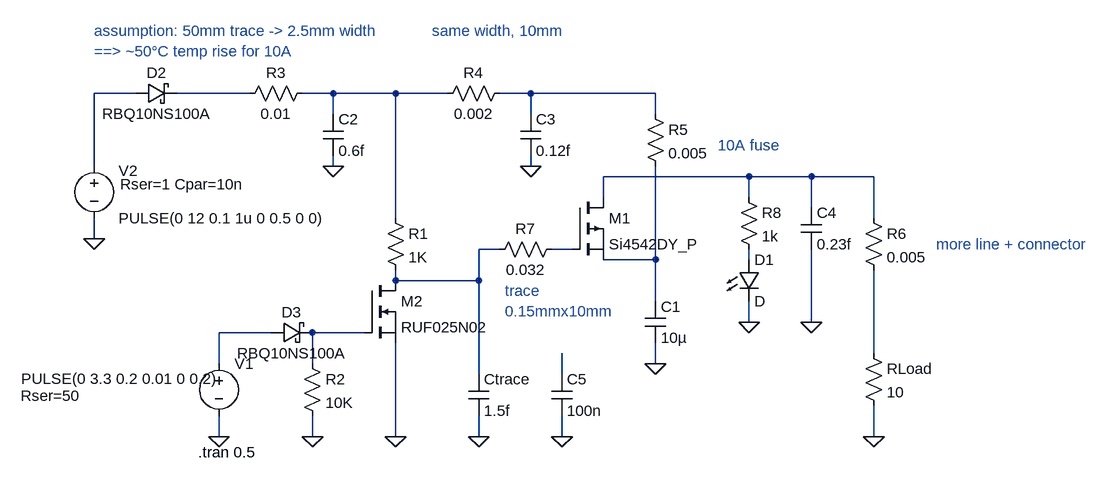
[diagram p0: schematic recovery_output.asc]
recovery_output.asc, the LTspice schematic file:
Version 4.1
SHEET 1 1044 1256
WIRE -448 -80 -512 -80
WIRE -272 -80 -384 -80
WIRE -144 -80 -192 -80
WIRE -48 -80 -144 -80
WIRE 32 -80 -48 -80
WIRE 160 -80 112 -80
WIRE 352 -80 160 -80
WIRE -144 -48 -144 -80
WIRE 160 -48 160 -80
WIRE 352 -48 352 -80
WIRE -512 32 -512 -80
WIRE -144 32 -144 16
WIRE 160 32 160 16
WIRE 496 48 272 48
WIRE 592 48 496 48
WIRE 688 48 592 48
WIRE 272 80 272 48
WIRE 496 80 496 48
WIRE 592 96 592 48
WIRE -48 112 -48 -80
WIRE 688 112 688 48
WIRE -512 144 -512 112
WIRE 112 160 80 160
WIRE 224 160 192 160
WIRE 352 176 352 32
WIRE 352 176 272 176
WIRE 496 176 496 160
WIRE -48 208 -48 192
WIRE 80 208 80 160
WIRE 80 208 -48 208
WIRE 352 240 352 176
WIRE 496 272 496 240
WIRE 592 272 592 160
WIRE -240 288 -320 288
WIRE -96 288 -176 288
WIRE 688 320 688 192
WIRE -320 336 -320 288
WIRE -176 336 -176 288
WIRE 352 336 352 304
WIRE 80 352 80 208
WIRE 208 352 208 320
WIRE -320 448 -320 416
WIRE -176 448 -176 416
WIRE -48 448 -48 304
WIRE 80 448 80 416
WIRE 208 448 208 416
WIRE 688 448 688 400
FLAG -176 448 0
FLAG -48 448 0
FLAG 80 448 0
FLAG 688 448 0
FLAG 352 336 0
FLAG -512 144 0
FLAG -320 448 0
FLAG 160 32 0
FLAG -144 32 0
FLAG 592 272 0
FLAG 496 272 0
FLAG 208 448 0
SYMBOL pmos 224 80 R0
SYMATTR InstName M1
SYMATTR Value Si4542DY_P
SYMBOL nmos -96 208 R0
SYMATTR InstName M2
SYMATTR Value RUF025N02
SYMBOL res -64 96 R0
SYMATTR InstName R1
SYMATTR Value 1K
SYMATTR SpiceLine tol=1 pwr=0.1
SYMBOL res -192 320 R0
SYMATTR InstName R2
SYMATTR Value 10K
SYMATTR SpiceLine tol=1 pwr=0.1
SYMBOL res 672 304 R0
SYMATTR InstName RLoad
SYMATTR Value 10
SYMATTR SpiceLine tol=1 pwr=0.1
SYMBOL cap 336 240 R0
SYMATTR InstName C1
SYMATTR Value 10µ
SYMATTR SpiceLine V=50 Irms=0 Rser=0 Lser=0
SYMBOL cap 64 352 R0
SYMATTR InstName Ctrace
SYMATTR Value 1.5f
SYMATTR SpiceLine V=25 Irms=0 Rser=0.0613 Lser=208p
SYMBOL voltage -320 320 R0
WINDOW 3 -304 39 Left 2
WINDOW 123 0 0 Left 0
WINDOW 39 -305 65 Left 2
SYMATTR InstName V1
SYMATTR Value PULSE(0 3.3 0.2 0.01 0 0.2)
SYMATTR SpiceLine Rser=50
SYMBOL voltage -512 16 R0
WINDOW 0 38 23 Left 2
WINDOW 3 38 96 Left 2
WINDOW 123 0 0 Left 0
WINDOW 39 40 44 Left 2
SYMATTR InstName V2
SYMATTR Value PULSE(0 12 0.1 1u 0 0.5 0 0)
SYMATTR SpiceLine Rser=1 Cpar=10n
SYMBOL res -176 -96 R90
WINDOW 0 0 56 VBottom 2
WINDOW 3 32 56 VTop 2
SYMATTR InstName R3
SYMATTR Value 0.01
SYMATTR SpiceLine tol=10
SYMBOL res 128 -96 R90
WINDOW 0 0 56 VBottom 2
WINDOW 3 32 56 VTop 2
SYMATTR InstName R4
SYMATTR Value 0.002
SYMBOL res 336 -64 R0
SYMATTR InstName R5
SYMATTR Value 0.005
SYMBOL res 672 96 R0
SYMATTR InstName R6
SYMATTR Value 0.005
SYMBOL res 208 144 R90
WINDOW 0 0 56 VBottom 2
WINDOW 3 32 56 VTop 2
SYMATTR InstName R7
SYMATTR Value 0.032
SYMBOL cap -160 -48 R0
SYMATTR InstName C2
SYMATTR Value 0.6f
SYMBOL cap 144 -48 R0
SYMATTR InstName C3
SYMATTR Value 0.12f
SYMBOL cap 576 96 R0
SYMATTR InstName C4
SYMATTR Value 0.23f
SYMBOL res 480 64 R0
SYMATTR InstName R8
SYMATTR Value 1k
SYMBOL LED 480 176 R0
SYMATTR InstName D1
SYMBOL schottky -448 -64 R270
WINDOW 0 32 32 VTop 2
WINDOW 3 0 32 VBottom 2
SYMATTR InstName D2
SYMATTR Value RBQ10NS100A
SYMBOL schottky -240 304 R270
WINDOW 0 32 32 VTop 2
WINDOW 3 0 32 VBottom 2
SYMATTR InstName D3
SYMATTR Value RBQ10NS100A
SYMBOL cap 192 352 R0
SYMATTR InstName C5
SYMATTR Value 100n
TEXT -352 472 Left 2 !.tran 0.5
TEXT -512 -176 Left 2 ;assumption: 50mm trace -> 2.5mm width\n==> ~50°C temp rise for 10A
TEXT 8 -176 Left 2 ;same width, 10mm
TEXT 448 0 Left 2 ;10A fuse
TEXT 784 152 Left 2 ;more line + connector
TEXT 120 224 Left 2 ;trace \n0.15mmx10mm

The netlist it stands for:
* recovery_output.asc
M1 N005 N007 N008 N008 Si4542DY_P
M2 N006 N011 0 0 RUF025N02
R1 N003 N006 1K tol=1 pwr=0.1
R2 N011 0 10K tol=1 pwr=0.1
RLoad N012 0 10 tol=1 pwr=0.1
C1 N008 0 10µ V=50 Irms=0 Rser=0 Lser=0
Ctrace N006 0 1.5f V=25 Irms=0 Rser=0.0613 Lser=208p
V1 N010 0 PULSE(0 3.3 0.2 0.01 0 0.2) Rser=50
V2 N001 0 PULSE(0 12 0.1 1u 0 0.5 0 0) Rser=1 Cpar=10n
R3 N003 N002 0.01 tol=10
R4 N004 N003 0.002
R5 N004 N008 0.005
R6 N005 N012 0.005
R7 N007 N006 0.032
C2 N003 0 0.6f
C3 N004 0 0.12f
C4 N005 0 0.23f
R8 N005 N009 1k
D1 N009 0 D
D2 N001 N002 RBQ10NS100A
D3 N010 N011 RBQ10NS100A
C5 N013 0 100n
.model D D
.lib standard.dio
.model NMOS NMOS
.model PMOS PMOS
.lib standard.mos
.tran 0.5
* assumption: 50mm trace -> 2.5mm width
* ==> ~50°C temp rise for 10A
* same width, 10mm
* 10A fuse
* more line + connector
* trace
* 0.15mmx10mm
.backanno
.end